# EAGLE design ATXBreakout (EAGLE 6.4)
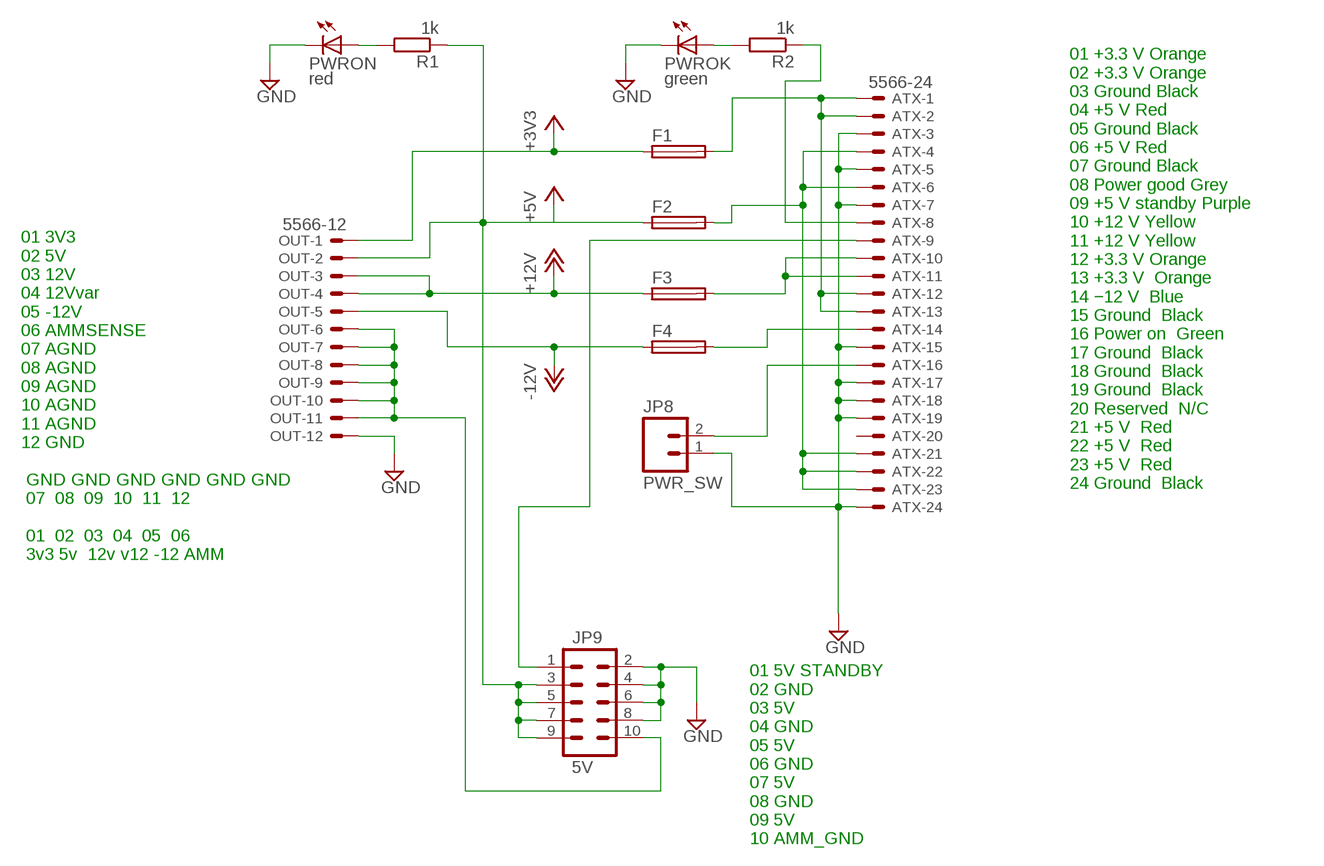
[diagram p0: schematic, sheet 1]

## Parts
ATX  5566-24  [5566-24]
F1  FUSESHK20Q  [SHK20Q]
F2  FUSESHK20Q  [SHK20Q]
F3  FUSESHK20Q  [SHK20Q]
F4  FUSESHK20Q  [SHK20Q]
JP8  PWR_SW  M02PTH  [1X02]
JP9  5V  M05X2PTH  [AVR_ICSP]
OUT  5566-12  [5566-12]
PWROK  green  LED5MM  [LED5MM]
PWRON  red  LED5MM  [LED5MM]
R1  1k  R-EU_0204/7  [0204/7]
R2  1k  R-EU_0204/7  [0204/7]

## Nets
+3V3: F1.1A OUT.1
+5V: F2.1A JP9.3 JP9.5 JP9.7 JP9.9 OUT.2 R1.1
+12V: F3.1A OUT.3 OUT.4
-12V: F4.1A OUT.5
GND: ATX.3 ATX.5 ATX.7 ATX.15 ATX.17 ATX.18 ATX.19 ATX.24 JP8.1 JP9.2 JP9.4 JP9.6 JP9.8 OUT.12 PWROK.K(C) PWRON.K(C)
N$1: ATX.1 ATX.2 ATX.12 ATX.13 F1.2A
N$2: ATX.4 ATX.6 ATX.21 ATX.22 ATX.23 F2.2A
N$3: ATX.10 ATX.11 F3.2A
N$4: ATX.14 F4.2A
N$5: PWRON.A R1.2
N$6: ATX.16 JP8.2
N$7: PWROK.A R2.2
N$8: ATX.8 R2.1
N$9: JP9.10 OUT.6 OUT.7 OUT.8 OUT.9 OUT.10 OUT.11
N$14: ATX.9 JP9.1
Unconnected: ATX.20

## Notes on the sheet
- 01 +3.3 V	Orange
  02 +3.3 V	Orange
  03 Ground	Black
  04 +5 V	Red
  05 Ground	Black
  06 +5 V	Red
  07 Ground	Black
  08 Power good	Grey
  09 +5 V standby Purple 	
  10 +12 V	Yellow
  11 +12 V	Yellow
  12 +3.3 V	Orange
  13 +3.3 V 	Orange
  14 −12 V 	Blue
  15 Ground 	Black
  16 Power on 	Green
  17 Ground 	Black
  18 Ground 	Black
  19 Ground 	Black
  20 Reserved 	N/C
  21 +5 V 	Red
  22 +5 V 	Red
  23 +5 V 	Red
  24 Ground 	Black
- 01 3V3
  02 5V
  03 12V
  04 12Vvar
  05 -12V
  06 AMMSENSE
  07 AGND
  08 AGND
  09 AGND
  10 AGND
  11 AGND
  12 GND
  
   GND GND GND GND GND GND
   07  08  09  10  11  12
  
   01  02  03  04  05  06
   3v3 5v  12v v12 -12 AMM
- 01 5V STANDBY
  02 GND
  03 5V
  04 GND
  05 5V
  06 GND
  07 5V
  08 GND
  09 5V
  10 AMM_GND

## Library data of the parts
ATX = con-molex:5566-24: Mini FIT connector 24 pol Source: http://www.molex.com
F1-F4 = fuse:FUSE: Fuse
JP8 = SparkFun-Connectors:M02: Standard 2-pin 0.1" header. Use with - straight break away headers ( PRT-00116) - right angle break away headers (PRT-00553) - swiss pins (PRT-00743) - machine pins (PRT-00117) - female headers (PRT-00115) Molex polarized connector foot print use with: PRT-08233 with associated crimp pins and housings. 2.54_SCREWTERM for use with PRT-10571. 3.5mm Screw Terminal footprints for PRT-08084 5mm Screw Terminal footprints for use with PRT-08433
JP9 = SparkFun-Connectors:M05X2: Header 5x2 Standard 10-pin dual row 0.1" header. Commonly used with AVR-ISP. Use with Spark Fun Electronics SKU: PRT-00778
OUT = con-molex:5566-12: Mini FIT connector 12 pol Source: http://www.molex.com
PWROK PWRON = led:LED: LED OSRAM: - CHIPLED LG R971, LG N971, LY N971, LG Q971, LY Q971, LO R971, LY R971 LH N974, LH R974 LS Q976, LO Q976, LY Q976 LO Q996 - Hyper CHIPLED LW Q18S LB Q993, LB Q99A, LB R99A - SideLED LS A670, LO A670, LY A670, LG A670, LP A670 LB A673, LV A673, LT A673, LW A673 LH A674 LY A675 LS A676, LA A676, LO A676, LY A676, LW A676 LS A679, LY A679, LG A679 - Hyper Micro SIDELED® LS Y876, LA Y876, LO Y876, LY Y876 LT Y87S - SmartLED LW L88C, LW L88S LB L89C, LB L89S, LG L890 LS L89K, LO L89K, LY L89K LS L896, LA L896, LO L896, LY L896 - TOPLED LS T670, LO T670, LY T670, LG T670, LP T670 LSG T670, LSP T670, LSY T670, LOP T670, LYG T670 LG T671, LOG T671, LSG T671 LB T673, LV T673, LT T673, LW T673 LH T674 LS T676, LA T676, LO T676, LY T676, LB T676, LH T676, LSB T676, LW T676 LB T67C, LV T67C, LT T67C, LS T67K, LO T67K, LY T67K, LW E67C LS E67B, LA E67B, LO E67B, LY E67B, LB E67C, LV E67C, LT E67C LW T67C LS T679, LY T679, LG T679 LS T770, LO T770, LY T770, LG T770, LP T770 LB T773, LV T773, LT T773, LW T773 LH T774 LS E675, LA E675, LY E675, LS T675 LS T776, LA T776, LO T776, LY T776, LB T776 LHGB T686 LT T68C, LB T68C - Hyper Mini TOPLED® LB M676 - Mini TOPLED Santana® LG M470 LS M47K, LO M47K, LY M47K Source: http://www.osram.convergy.de LUXEON: - LUMILED® LXK2-PW12-R00, LXK2-PW12-S00, LXK2-PW14-U00, LXK2-PW14-V00 LXK2-PM12-R00, LXK2-PM12-S00, LXK2-PM14-U00 LXK2-PE12-Q00, LXK2-PE12-R00, LXK2-PE12-S00, LXK2-PE14-T00, LXK2-PE14-U00 LXK2-PB12-K00, LXK2-PB12-L00, LXK2-PB12-M00, LXK2-PB14-N00, LXK2-PB14-P00, LXK2-PB14-Q00 LXK2-PR12-L00, LXK2-PR12-M00, LXK2-PR14-Q00, LXK2-PR14-R00 LXK2-PD12-Q00, LXK2-PD12-R00, LXK2-PD12-S00 LXK2-PH12-R00, LXK2-PH12-S00 LXK2-PL12-P00, LXK2-PL12-Q00, LXK2-PL12-R00 Source: www.luxeon.com KINGBRIGHT: KA-3528ASYC Source: www.kingbright.com
R1 R2 = resistor:R-EU_: RESISTOR, European symbol

## Board
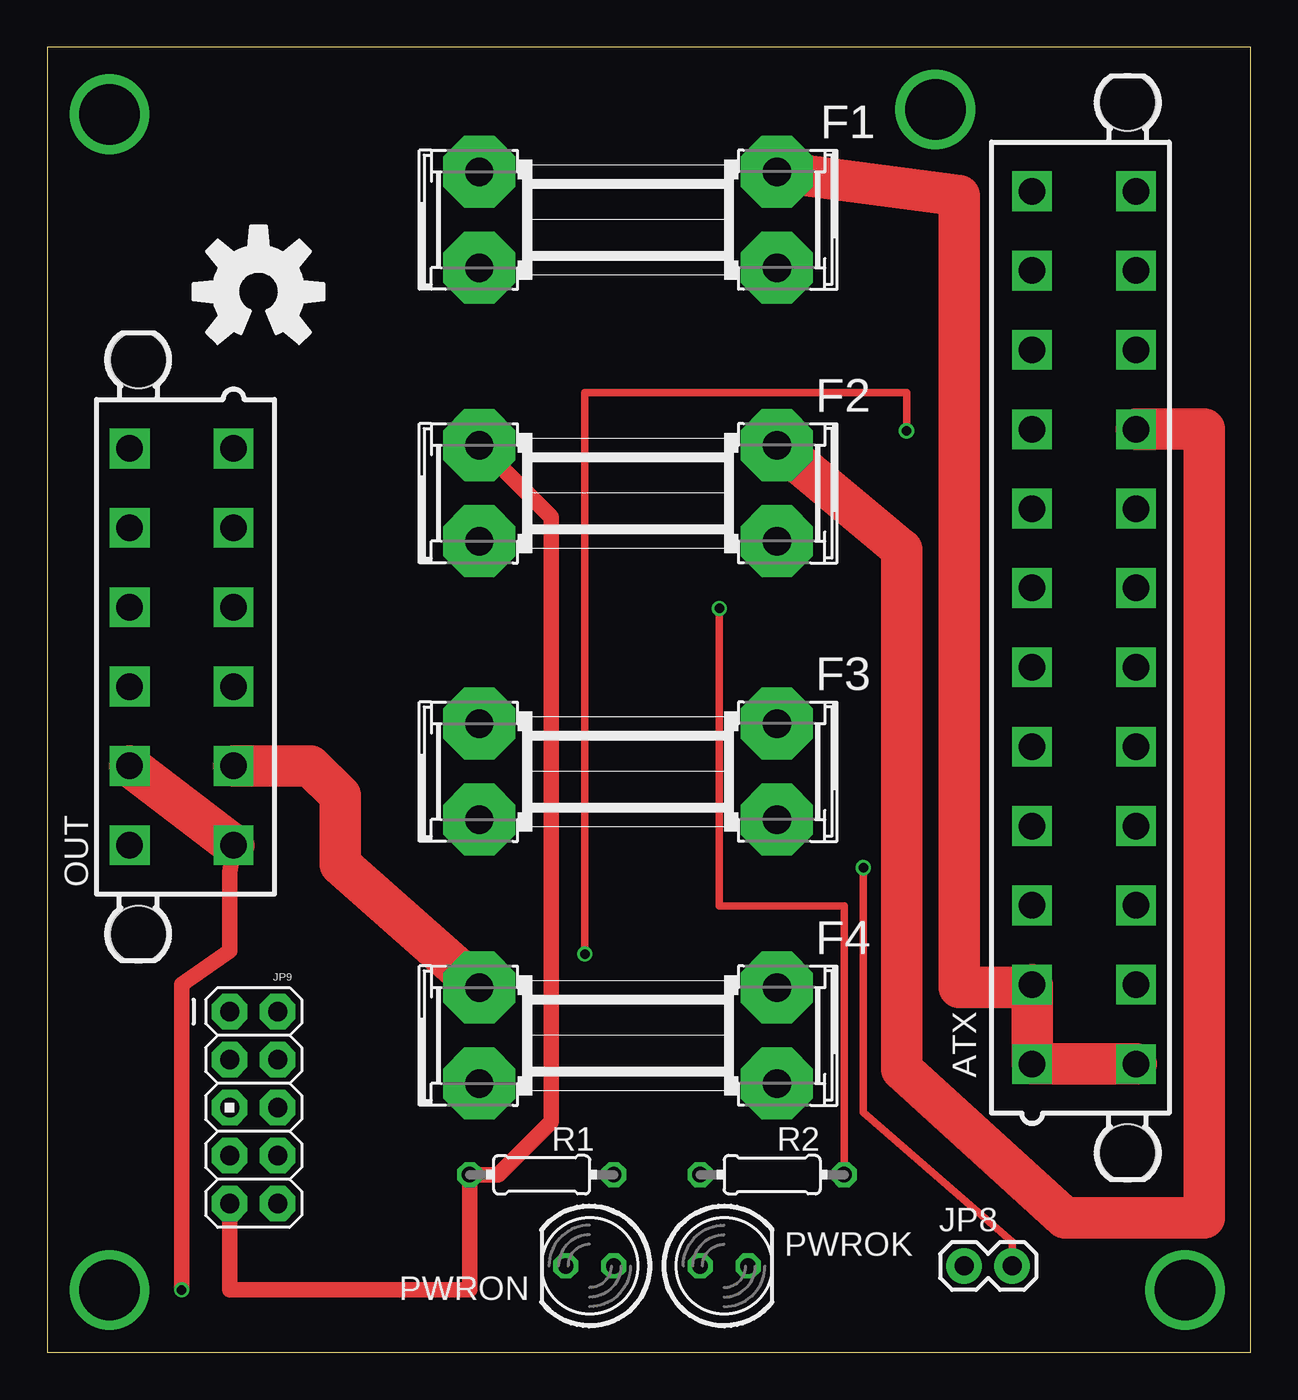
[diagram p1: board, top side]
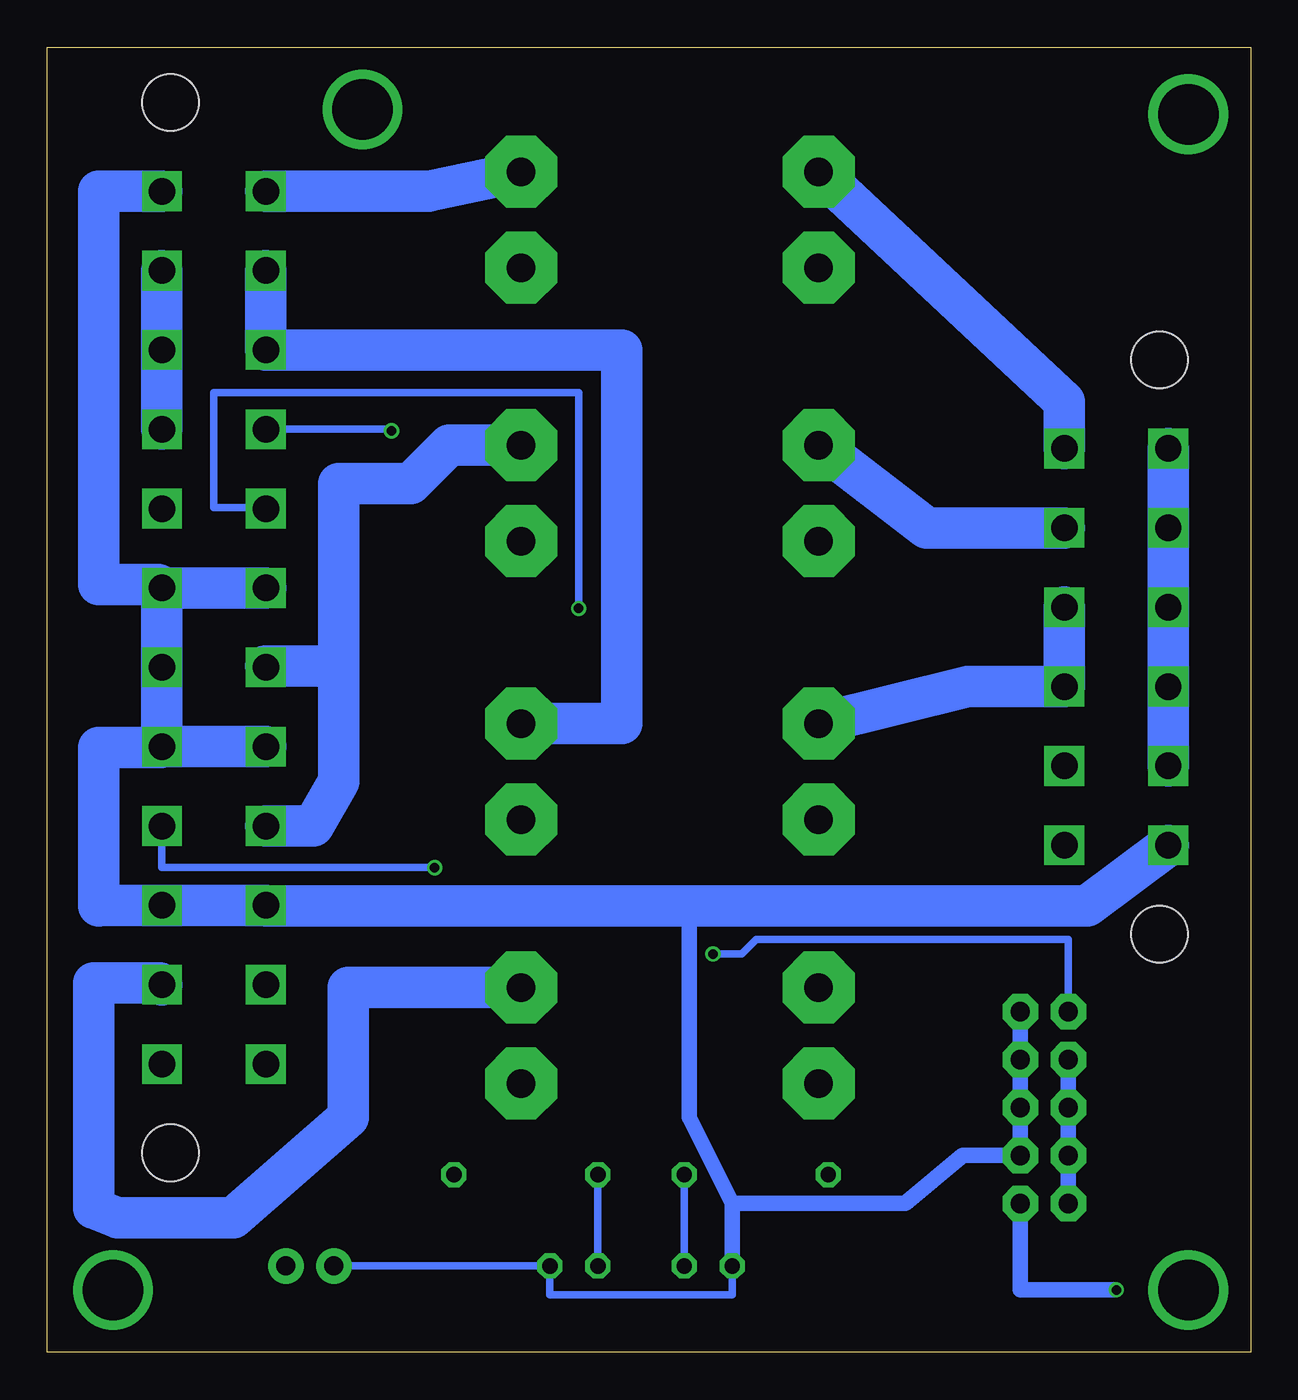
[diagram p2: board, bottom side, seen from below]

Size 63.68 x 69.08 mm. Coordinates in mm from the lower left corner, seen from the top.
Outline: 0,0 63.68,0 63.68,69.08 0,69.08 0,0
Copper layers (1*16): Top 0.035mm / dielectric 1.5mm / Bottom 0.035mm
Design rules "SeeedStudio_2layer_DRU_no_angle_20140221": minimum track width 6mil, minimum drill 12mil, track to track 6mil, track to pad 6mil, pad to pad 6mil, via to via 6mil, smd to smd 0mil, copper to edge 10mil, drill to drill 10mil, minimum pad ring 10mil, minimum via ring 6mil, stop-mask expansion 2mil, vias tented up to drill 100mil, thermal gap 10mil

### Footprints (pad centres in the part's own frame; a part is rotated, then mirrored left to right if it is on the bottom)
5566-24 = drill 1.4 square: 1 23.1,-2.75; 2 18.9,-2.75; 3 14.7,-2.75; 4 10.5,-2.75; 5 6.3,-2.75; 6 2.1,-2.75; 7 -2.1,-2.75; 8 -6.3,-2.75; 9 -10.5,-2.75; 10 -14.7,-2.75; 11 -18.9,-2.75; 12 -23.1,-2.75; 13 23.1,2.75; 14 18.9,2.75; 15 14.7,2.75; 16 10.5,2.75; 17 6.3,2.75; 18 2.1,2.75; 19 -2.1,2.75; 20 -6.3,2.75; 21 -10.5,2.75; 22 -14.7,2.75; 23 -18.9,2.75; 24 -23.1,2.75 | hole 3: 27.8,2.29; -27.8,2.29
SHK20Q = drill 1.5 pad 3.81 octagon: 1A -7.874,2.54; 1B -7.874,-2.54; 2A 7.874,2.54; 2B 7.874,-2.54
1X02 = drill 1.016 pad 1.88: 1 0,0; 2 2.54,0
AVR_ICSP = drill 1.016 pad 1.88 octagon: 1 -1.27,5.08; 2 1.27,5.08; 3 -1.27,2.54; 4 1.27,2.54; 5 -1.27,0; 6 1.27,0; 7 -1.27,-2.54; 8 1.27,-2.54; 9 -1.27,-5.08; 10 1.27,-5.08
5566-12 = drill 1.4 square: 1 10.5,-2.75; 2 6.3,-2.75; 3 2.1,-2.75; 4 -2.1,-2.75; 5 -6.3,-2.75; 6 -10.5,-2.75; 7 10.5,2.75; 8 6.3,2.75; 9 2.1,2.75; 10 -2.1,2.75; 11 -6.3,2.75; 12 -10.5,2.75 | hole 3: 15.2,2.29; -15.2,2.29
LED5MM = drill 0.813 octagon: A -1.27,0; K 1.27,0
0204/7 = drill 0.813 octagon: 1 -3.81,0; 2 3.81,0

### Placement (x,y rotation side)
ATX  54.86,38.35 270 top
F1  30.73,59.94 0 top
F2  30.73,45.47 0 top
F3  30.73,30.73 0 top
F4  30.73,16.76 0 top
JP8  48.51,4.57 0 top
JP9  10.92,12.95 0 top
OUT  7.11,37.34 90 top
PWROK  35.81,4.57 0 top
PWRON  28.7,4.57 180 top
R1  26.16,9.4 0 top
R2  38.35,9.4 180 top
U$1  [OSHW-LOGO-L]  11.18,56.13 0 top

### Tracks (layer width: path | path; a pad name or v marks a point on that pad's centre or on a via)
+3V3
  Bottom 2.184: F1.1A 9.86,50.32 OUT.1
+5V
  Top 0.813: JP9.9 9.65,3.3 22.35,3.3 R1.1 23.88,9.4 26.67,12.19 26.67,44.2 F2.1A
  Bottom 0.813: JP9.9 JP9.7 JP9.5 JP9.3
  Bottom 2.184: F2.1A 17.15,43.64 OUT.2
+12V
  Bottom 2.184: OUT.3 OUT.4 14.98,35.24 F3.1A
-12V
  Top 2.184: OUT.5 13.92,31.04 15.49,29.46 15.49,25.83 F4.1A
GND
  Bottom 0.406: JP8.1 PWROK.K 37.08,3.05 27.43,3.05 PWRON.K
  Bottom 0.813: JP9.2 JP9.4 JP9.6 JP9.8 15.24,10.41 18.29,7.87 27.43,7.87 | 27.43,7.87 PWRON.K | 29.72,23.62 29.72,12.45 27.43,7.87
  Bottom 2.184: ATX.17 57.66,32 60.96,32 60.96,23.62 60.93,23.65 ATX.15 ATX.3 52.08,23.62 29.72,23.62 8.64,23.62 OUT.12 | ATX.17 ATX.5 | ATX.17 ATX.18 ATX.19 | ATX.19 ATX.7 | ATX.24 60.95,61.45 60.96,61.47 60.96,40.64 57.8,40.64 ATX.19
N$1
  Top 2.184: F1.2A 48.26,61.21 48.26,19.3 51.96,19.3 ATX.2 ATX.1 ATX.13
  Bottom 2.184: ATX.12 43.5,61.45 F1.2A
N$2
  Top 2.184: ATX.21 61.21,48.85 61.21,7.11 53.85,7.11 45.21,14.99 45.21,42.49 F2.2A
  Bottom 0.406: 52.11,36.32 ATX.6
  Bottom 2.184: F2.2A 42.42,48.01 44.45,45.97 48.26,45.97 48.26,36.32 | 48.26,36.32 52.11,36.32 | ATX.21 ATX.22 ATX.23 | ATX.4 49.62,27.85 48.26,30.23 48.26,36.32
N$3
  Bottom 2.184: F3.2A 33.27,33.27 33.27,53.05 ATX.10 ATX.11
N$4
  Bottom 2.184: F4.2A 47.75,19.3 47.75,12.45 53.85,7.11 59.94,7.11 61.21,7.62 61.21,19.56 57.72,19.56 ATX.14
N$5
  Bottom 0.406: R1.2 PWRON.A
N$6  (via drill 0.5)
  Top 0.406: v43.18,25.65 43.18,12.7 51.05,5.84 JP8.2
  Bottom 0.406: ATX.16 57.61,25.65 v43.18,25.65
N$7
  Bottom 0.406: R2.2 PWROK.A
N$8  (via drill 0.5)
  Top 0.406: R2.1 42.16,23.62 35.56,23.62 v35.56,39.37
  Bottom 0.406: v35.56,39.37 35.56,50.8 54.86,50.8 54.86,44.7 52.11,44.7 ATX.8
N$9  (via drill 0.5)
  Top 0.813: v7.11,3.3 7.11,19.47 9.65,21.25 9.65,25.4 OUT.6
  Top 2.184: OUT.11 OUT.6
  Bottom 0.813: JP9.10 12.19,3.3 v7.11,3.3
  Bottom 2.184: OUT.7 OUT.8 OUT.9 OUT.10 OUT.11
N$10  (via drill 3.2 pad 3.81)
  other vias: 3.3,65.53
N$11  (via drill 3.2 pad 3.81)
  other vias: 46.99,65.79
N$12  (via drill 3.2 pad 3.81)
  other vias: 60.2,3.3
N$13  (via drill 3.2 pad 3.81)
  other vias: 3.3,3.3
N$14  (via drill 0.5)
  Top 0.406: v45.47,48.77 45.47,50.8 28.45,50.8 v28.45,21.08
  Bottom 0.406: ATX.9 45.47,48.85 v45.47,48.77 | v28.45,21.08 26.92,21.08 26.16,21.84 9.65,21.84 JP9.1

### Text on the board
Document: noti, 2014 | 3V3 | 5V | 12Vvar | 12V | -12V | AMM | 5V | standby | GND | 5V | GNDa
tDocu: ATX BREAKOUT BOARD | v1.1
bDocu: Use fuses that match your / PSU's specifications!